# EAGLE design main (EAGLE 8.7.0)
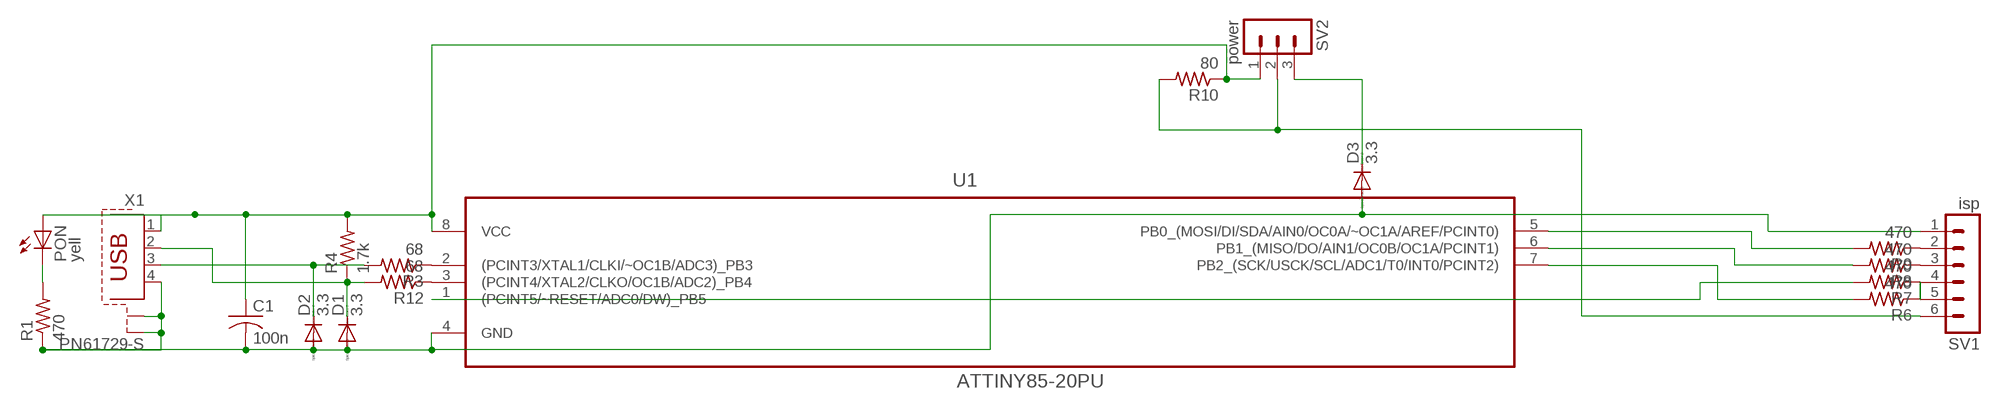
[diagram p0: schematic, sheet 1]

## Parts
C1  100n  C-USC0805K  [C0805K]
D1  3.3  DIODE-MELF-MLL41  [MELF-MLL41]
D2  3.3  DIODE-MELF-MLL41  [MELF-MLL41]
D3  3.3  DIODE-MELF-MLL41  [MELF-MLL41]
PON  yell  LED5MM  [LED5MM]
R1  470  R-US_R0805  [R0805]
R3  68  R-US_R0805  [R0805]
R4  1.7k  R-US_R0805  [R0805]
R6  470  R-US_R0805  [R0805]
R7  470  R-US_0207/12  [0207/12]
R8  470  R-US_R0805  [R0805]
R9  470  R-US_R0805  [R0805]
R10  80  R-US_R0805  [R0805]
R12  68  R-US_R0805  [R0805]
SV1  isp  MA06-1  [MA06-1]
SV2  power  MA03-1  [MA03-1]
U1  ATTINY85-20PU  [DIP254P762X533-8]
X1  PN61729-S  [PN61729-S]

## Nets
N$2: D1.C R4.1 R12.2 X1.2
N$3: R3.1 U1.2((PCINT3/XTAL1/CLKI/~OC1B/ADC3)_PB3)
N$4: R12.1 U1.3((PCINT4/XTAL2/CLKO/OC1B/ADC2)_PB4)
N$5: R9.2 U1.5(PB0_(MOSI/DI/SDA/AIN0/OC0A/~OC1A/AREF/PCINT0))
N$6: D2.C R3.2 X1.3
N$7: C1.2 D1.A D2.A D3.A R1.1 SV1.1 U1.4(GND) X1.4 X1.S1 X1.S2
N$8: R8.2 U1.6(PB1_(MISO/DO/AIN1/OC0B/OC1A/PCINT1))
N$9: R6.2 U1.7(PB2_(SCK/USCK/SCL/ADC1/T0/INT0/PCINT2))
N$10: R9.1 SV1.2
N$11: PON.K(C) R1.2
N$12: R7.2 U1.1((PCINT5/~RESET/ADC0/DW)_PB5)
N$13: R8.1 SV1.3
N$14: R7.1 SV1.5
N$15: R6.1 SV1.4
N$18: D3.C SV2.3
N$19: R10.2 SV1.6 SV2.2
N$21: C1.1 PON.A R4.2 R10.1 SV2.1 U1.8(VCC) X1.1

## Library data of the parts
C1 = rcl:C-US: CAPACITOR, American symbol; SPICEPREFIX: C
D1-D3 = diode:DIODE-: DIODE
PON = led:LED: LED OSRAM: - CHIPLED LG R971, LG N971, LY N971, LG Q971, LY Q971, LO R971, LY R971 LH N974, LH R974 LS Q976, LO Q976, LY Q976 LO Q996 - Hyper CHIPLED LW Q18S LB Q993, LB Q99A, LB R99A - SideLED LS A670, LO A670, LY A670, LG A670, LP A670 LB A673, LV A673, LT A673, LW A673 LH A674 LY A675 LS A676, LA A676, LO A676, LY A676, LW A676 LS A679, LY A679, LG A679 - Hyper Micro SIDELED® LS Y876, LA Y876, LO Y876, LY Y876 LT Y87S - SmartLED LW L88C, LW L88S LB L89C, LB L89S, LG L890 LS L89K, LO L89K, LY L89K LS L896, LA L896, LO L896, LY L896 - TOPLED LS T670, LO T670, LY T670, LG T670, LP T670 LSG T670, LSP T670, LSY T670, LOP T670, LYG T670 LG T671, LOG T671, LSG T671 LB T673, LV T673, LT T673, LW T673 LH T674 LS T676, LA T676, LO T676, LY T676, LB T676, LH T676, LSB T676, LW T676 LB T67C, LV T67C, LT T67C, LS T67K, LO T67K, LY T67K, LW E67C LS E67B, LA E67B, LO E67B, LY E67B, LB E67C, LV E67C, LT E67C LW T67C LS T679, LY T679, LG T679 LS T770, LO T770, LY T770, LG T770, LP T770 LB T773, LV T773, LT T773, LW T773 LH T774 LS E675, LA E675, LY E675, LS T675 LS T776, LA T776, LO T776, LY T776, LB T776 LHGB T686 LT T68C, LB T68C - Hyper Mini TOPLED® LB M676 - Mini TOPLED Santana® LG M470 LS M47K, LO M47K, LY M47K Source: http://www.osram.convergy.de LUXEON: - LUMILED® LXK2-PW12-R00, LXK2-PW12-S00, LXK2-PW14-U00, LXK2-PW14-V00 LXK2-PM12-R00, LXK2-PM12-S00, LXK2-PM14-U00 LXK2-PE12-Q00, LXK2-PE12-R00, LXK2-PE12-S00, LXK2-PE14-T00, LXK2-PE14-U00 LXK2-PB12-K00, LXK2-PB12-L00, LXK2-PB12-M00, LXK2-PB14-N00, LXK2-PB14-P00, LXK2-PB14-Q00 LXK2-PR12-L00, LXK2-PR12-M00, LXK2-PR14-Q00, LXK2-PR14-R00 LXK2-PD12-Q00, LXK2-PD12-R00, LXK2-PD12-S00 LXK2-PH12-R00, LXK2-PH12-S00 LXK2-PL12-P00, LXK2-PL12-Q00, LXK2-PL12-R00 Source: www.luxeon.com KINGBRIGHT: KA-3528ASYC Source: www.kingbright.com
R1 R3 R4 R6-R10 R12 = resistor:R-US_: RESISTOR, American symbol
SV1 = con-lstb:MA06-1: PIN HEADER; OC_FARNELL: unknown; OC_NEWARK: unknown
SV2 = con-lstb:MA03-1: PIN HEADER; OC_FARNELL: unknown; OC_NEWARK: unknown
U1 = Atmel_By_element14_Batch_1-00:ATTINY85-20PU: 8-bit Microcontroller with In-System Programmable Flash; MPN: ATTINY85-20PU; OC_FARNELL: 1455162; OC_NEWARK: 58M3796; PACKAGE: PDIP-8; SUPPLIER: Atmel
X1 = con-berg:PN61729-S: BERG USB connector; OC_FARNELL: unknown; OC_NEWARK: unknown

## Board
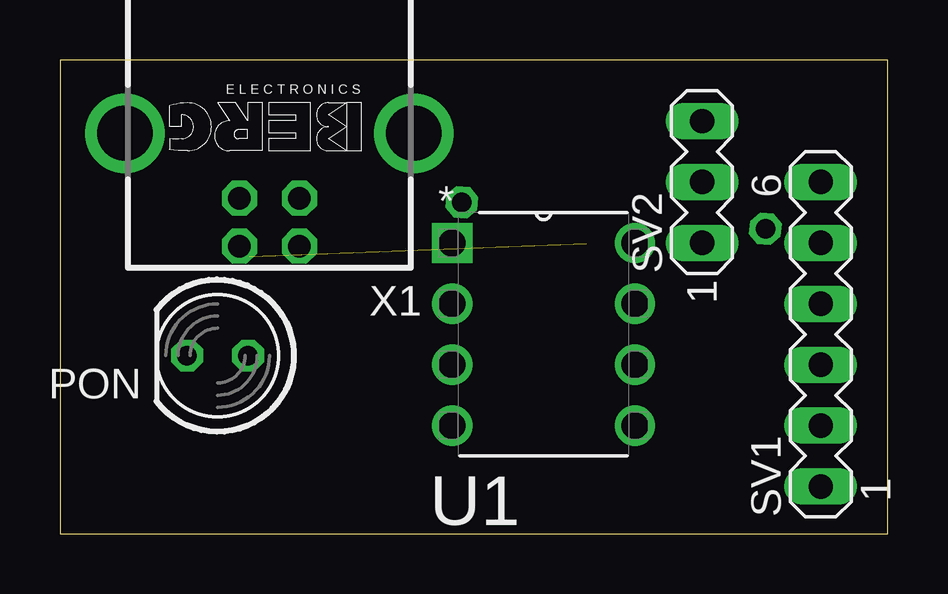
[diagram p1: board, top side]
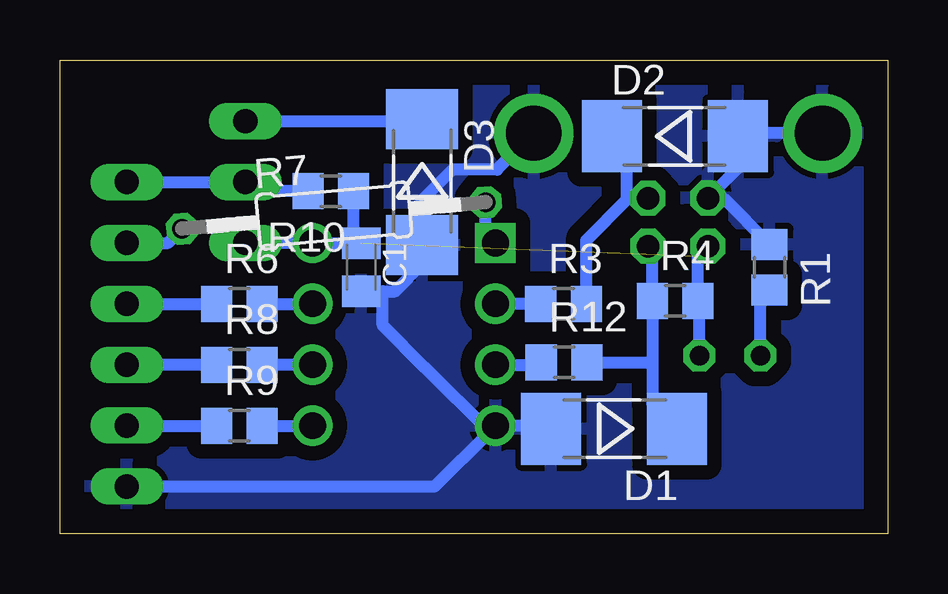
[diagram p2: board, bottom side, seen from below]

Size 34.5 x 19.75 mm. Coordinates in mm from the lower left corner, seen from the top.
Outline: 0,0 34.5,0 34.5,19.75 0,19.75 0,0
Copper layers (1*16): Top 0.035mm / dielectric 1.5mm / Bottom 0.035mm
Design rules "default": minimum track width 6mil, minimum drill 0.35mm, track to track 6mil, track to pad 6mil, pad to pad 6mil, via to via 6mil, smd to smd 6mil, copper to edge 40mil, drill to drill 6mil, minimum pad ring 10mil, minimum via ring 8mil, stop-mask expansion 4mil, vias tented up to drill 0mil, thermal gap 10mil

### Footprints (pad centres in the part's own frame; a part is rotated, then mirrored left to right if it is on the bottom)
C0805K = smd 1.3 x 1.6: 1 -1,0; 2 1,0
MELF-MLL41 = smd 2.5 x 3: A 2.625,0; C -2.625,0
LED5MM = drill 0.813 octagon: A -1.27,0; K 1.27,0
R0805 = smd 1.3 x 1.5: 1 -0.95,0; 2 0.95,0
0207/12 = drill 0.813 octagon: 1 -6.35,0; 2 6.35,0
MA06-1 = drill 1.016 long: 1 -6.35,0; 2 -3.81,0; 3 -1.27,0; 4 1.27,0; 5 3.81,0; 6 6.35,0
MA03-1 = drill 1.016 long: 1 -2.54,0; 2 0,0; 3 2.54,0
DIP254P762X533-8 = drill 1.118 square: 1 -7.62,7.62 | drill 1.118: 2 -7.62,5.08; 3 -7.62,2.54; 4 -7.62,0; 5 0,0; 6 0,2.54; 7 0,5.08; 8 0,7.62
PN61729-S = drill 0.95 octagon: 1 1.25,4.71; 2 -1.25,4.71; 3 -1.25,2.71; 4 1.25,2.71 | drill 2.3 pad 2.9: S1 -6.02,0; S2 6.02,0

### Placement (x,y rotation side)
C1  21.94,11.11 270 bottom
D1  11.4,4.38 180 bottom
D2  8.86,16.57 0 bottom
D3  19.4,14.66 270 bottom
PON  6.57,7.43 180 top
R1  4.92,11.11 270 bottom
R3  13.51,9.58 0 bottom
R4  8.86,9.71 0 bottom
R6  27.02,9.58 0 bottom
R7  23.08,13.27 5 bottom
R8  27.02,7.04 0 bottom
R9  27.02,4.5 0 bottom
R10  23.21,14.28 180 bottom
R12  13.48,7.15 0 bottom
SV1  31.72,8.31 90 top
SV2  26.76,14.66 90 top
U1  23.97,4.5 0 top
X1  8.73,16.7 180 top

### Tracks (layer width: path | path; a pad name or v marks a point on that pad's centre or on a via)
N$2
  Bottom 0.508: X1.2 9.81,11.81 R4.1 9.81,7.17 | 9.81,7.17 9.81,5.41 D1.C | R12.2 9.83,7.15 9.81,7.17
N$3
  Bottom 0.508: R3.1 U1.2
N$4
  Bottom 0.508: U1.3 14.54,7.04 R12.1
N$5
  Bottom 0.508: R9.2 U1.5
N$6
  Bottom 0.508: R3.2 12.56,12.23 10.89,13.9 | X1.3 10.81,13.99 10.89,13.9 | D2.C 10.89,15.98 10.89,13.9
N$7
  Bottom 0.508: R1.1 6.85,13.99 X1.4 6.23,15.23 D2.A 6.1,16.7 X1.S2 | D1.A 14.15,4.5 U1.4 16.6,4.25 | SV1.1 18.89,1.96 16.6,4.25 | 16.6,4.25 19.27,6.92 21.05,8.7 21.05,10.11 | X1.S1 16.27,15.17 18.13,15.17 19.4,13.9 D3.A 19.4,11.24 20.53,10.11 21.05,10.11 | C1.2 21.05,10.11
  pour Bottom (isolate 0.61): -0.03,19.74 34.64,19.74 34.64,-0.07 -0.03,-0.07
N$8
  Bottom 0.508: U1.6 R8.2
N$9
  Bottom 0.508: R6.2 U1.7
N$10
  Bottom 0.508: SV1.2 R9.1
N$11
  Bottom 0.508: PON.K 5.3,9.78 R1.2
N$12
  Bottom 0.508: U1.1 16.75,12.53 R7.2
N$13
  Bottom 0.508: R8.1 SV1.3
N$14
  Bottom 0.508: SV1.5 30,12.12 R7.1
N$15
  Bottom 0.508: SV1.4 R6.1
N$18
  Bottom 0.508: SV2.3 19.48,17.2 D3.C
N$19
  Bottom 0.508: SV1.6 SV2.2 26.38,14.28 R10.2 24.21,14.33
N$21  (1 unrouted)
  Bottom 0.508: SV2.1 U1.8 23.95,12.11 C1.1 22.26,12.43 R10.1 | X1.1 7.91,11.56 R4.2 7.84,9.64 PON.A